# EAGLE schematic VCO 3340 (EAGLE 9.6.2)

## Sheet 1 of 2
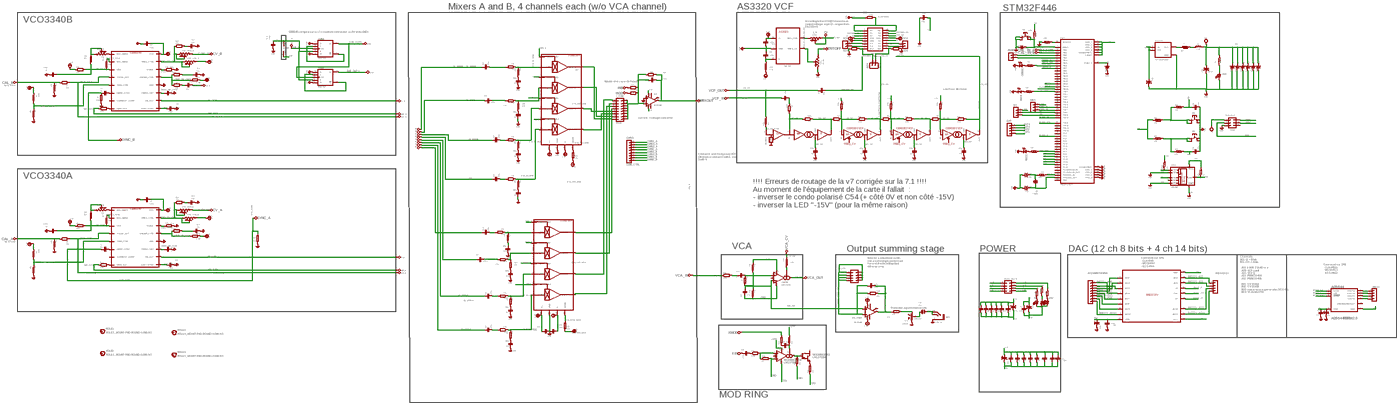
[diagram p0: schematic, sheet 1, overview]
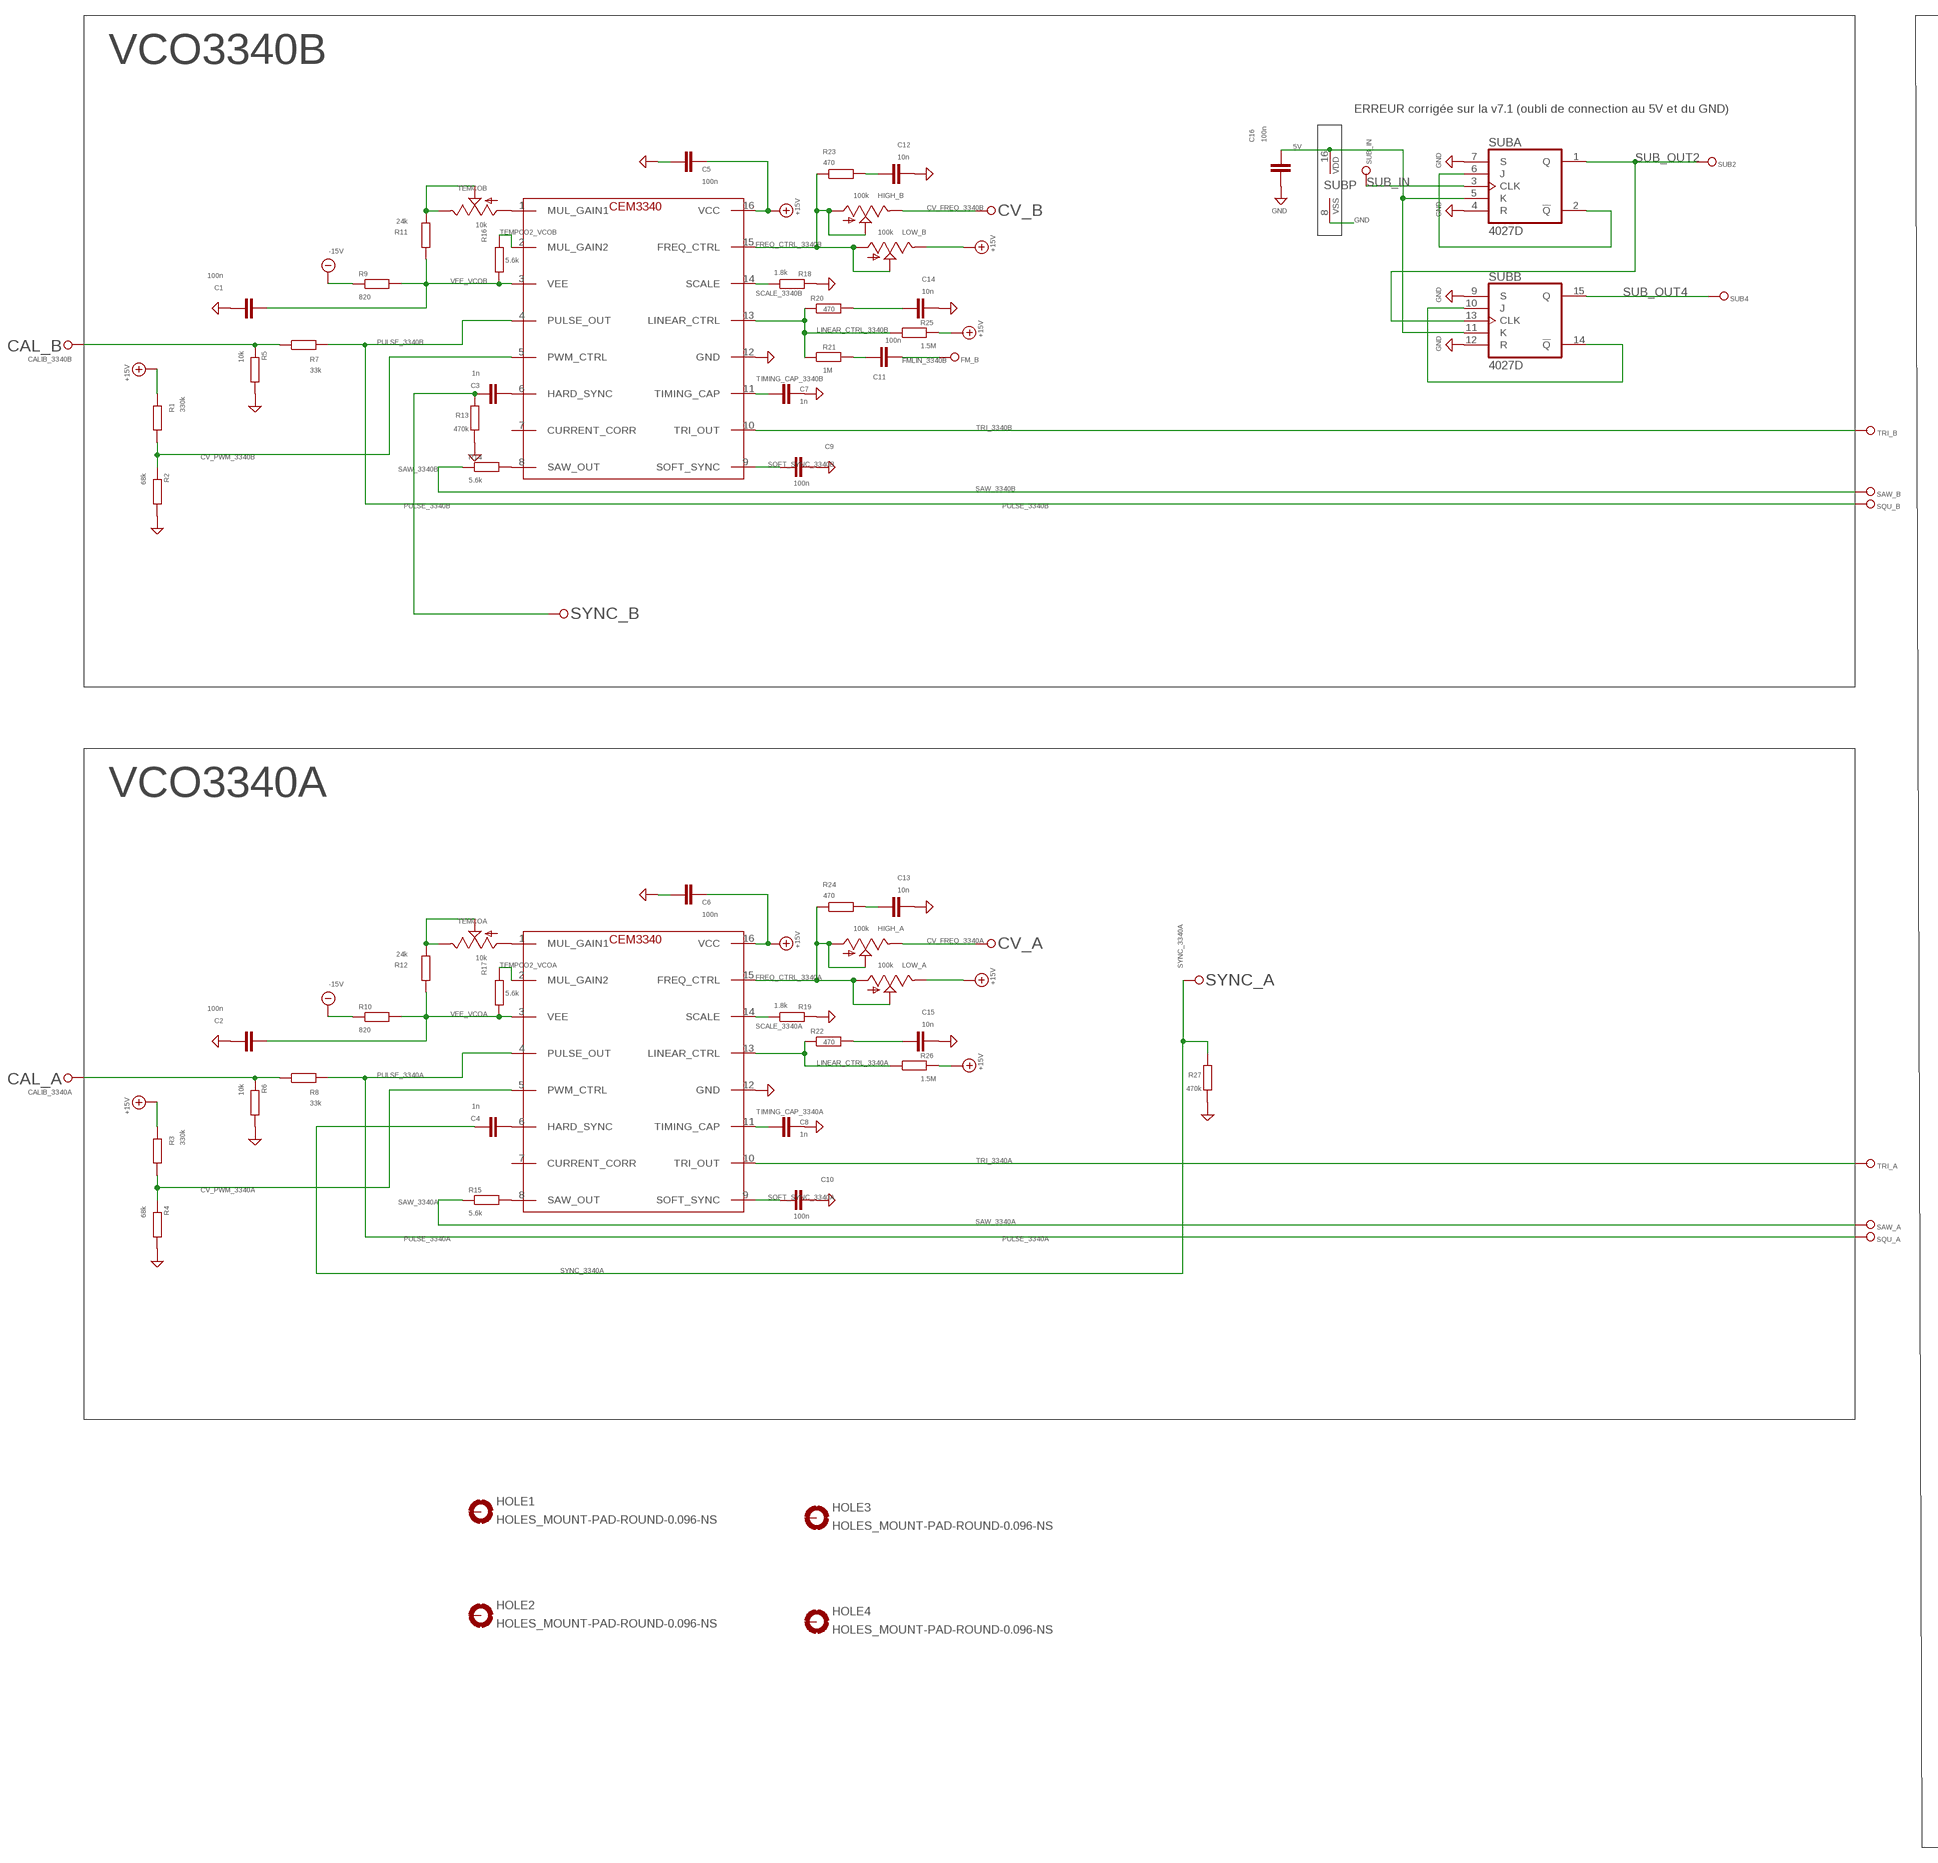
[diagram p1: schematic, sheet 1, part 1 of 4]
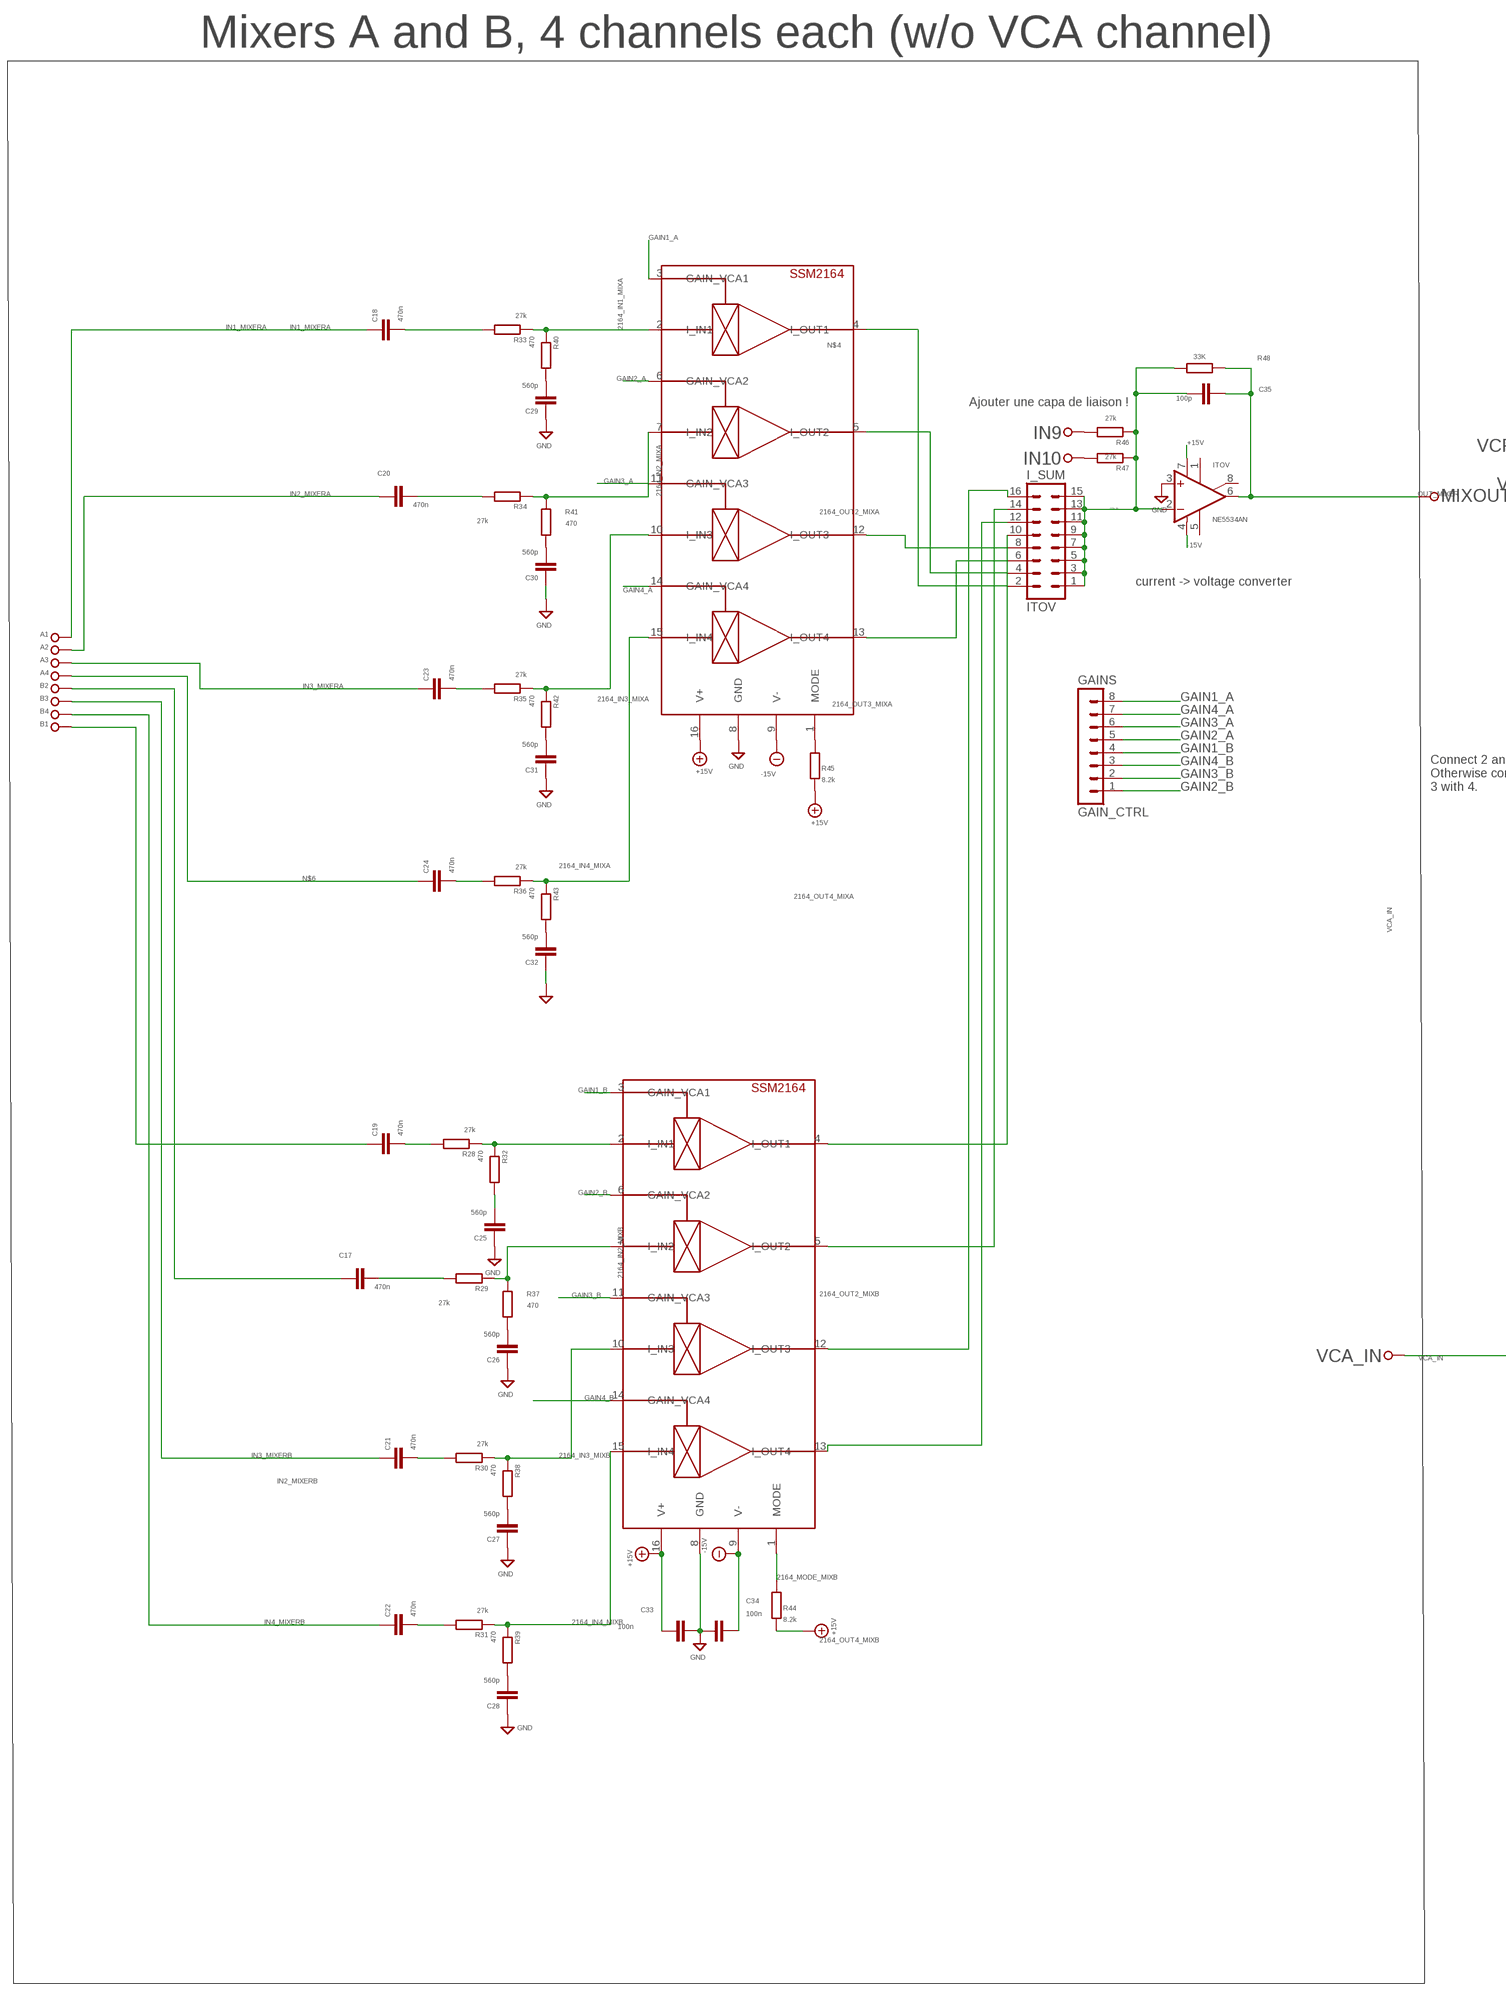
[diagram p2: schematic, sheet 1, part 2 of 4]
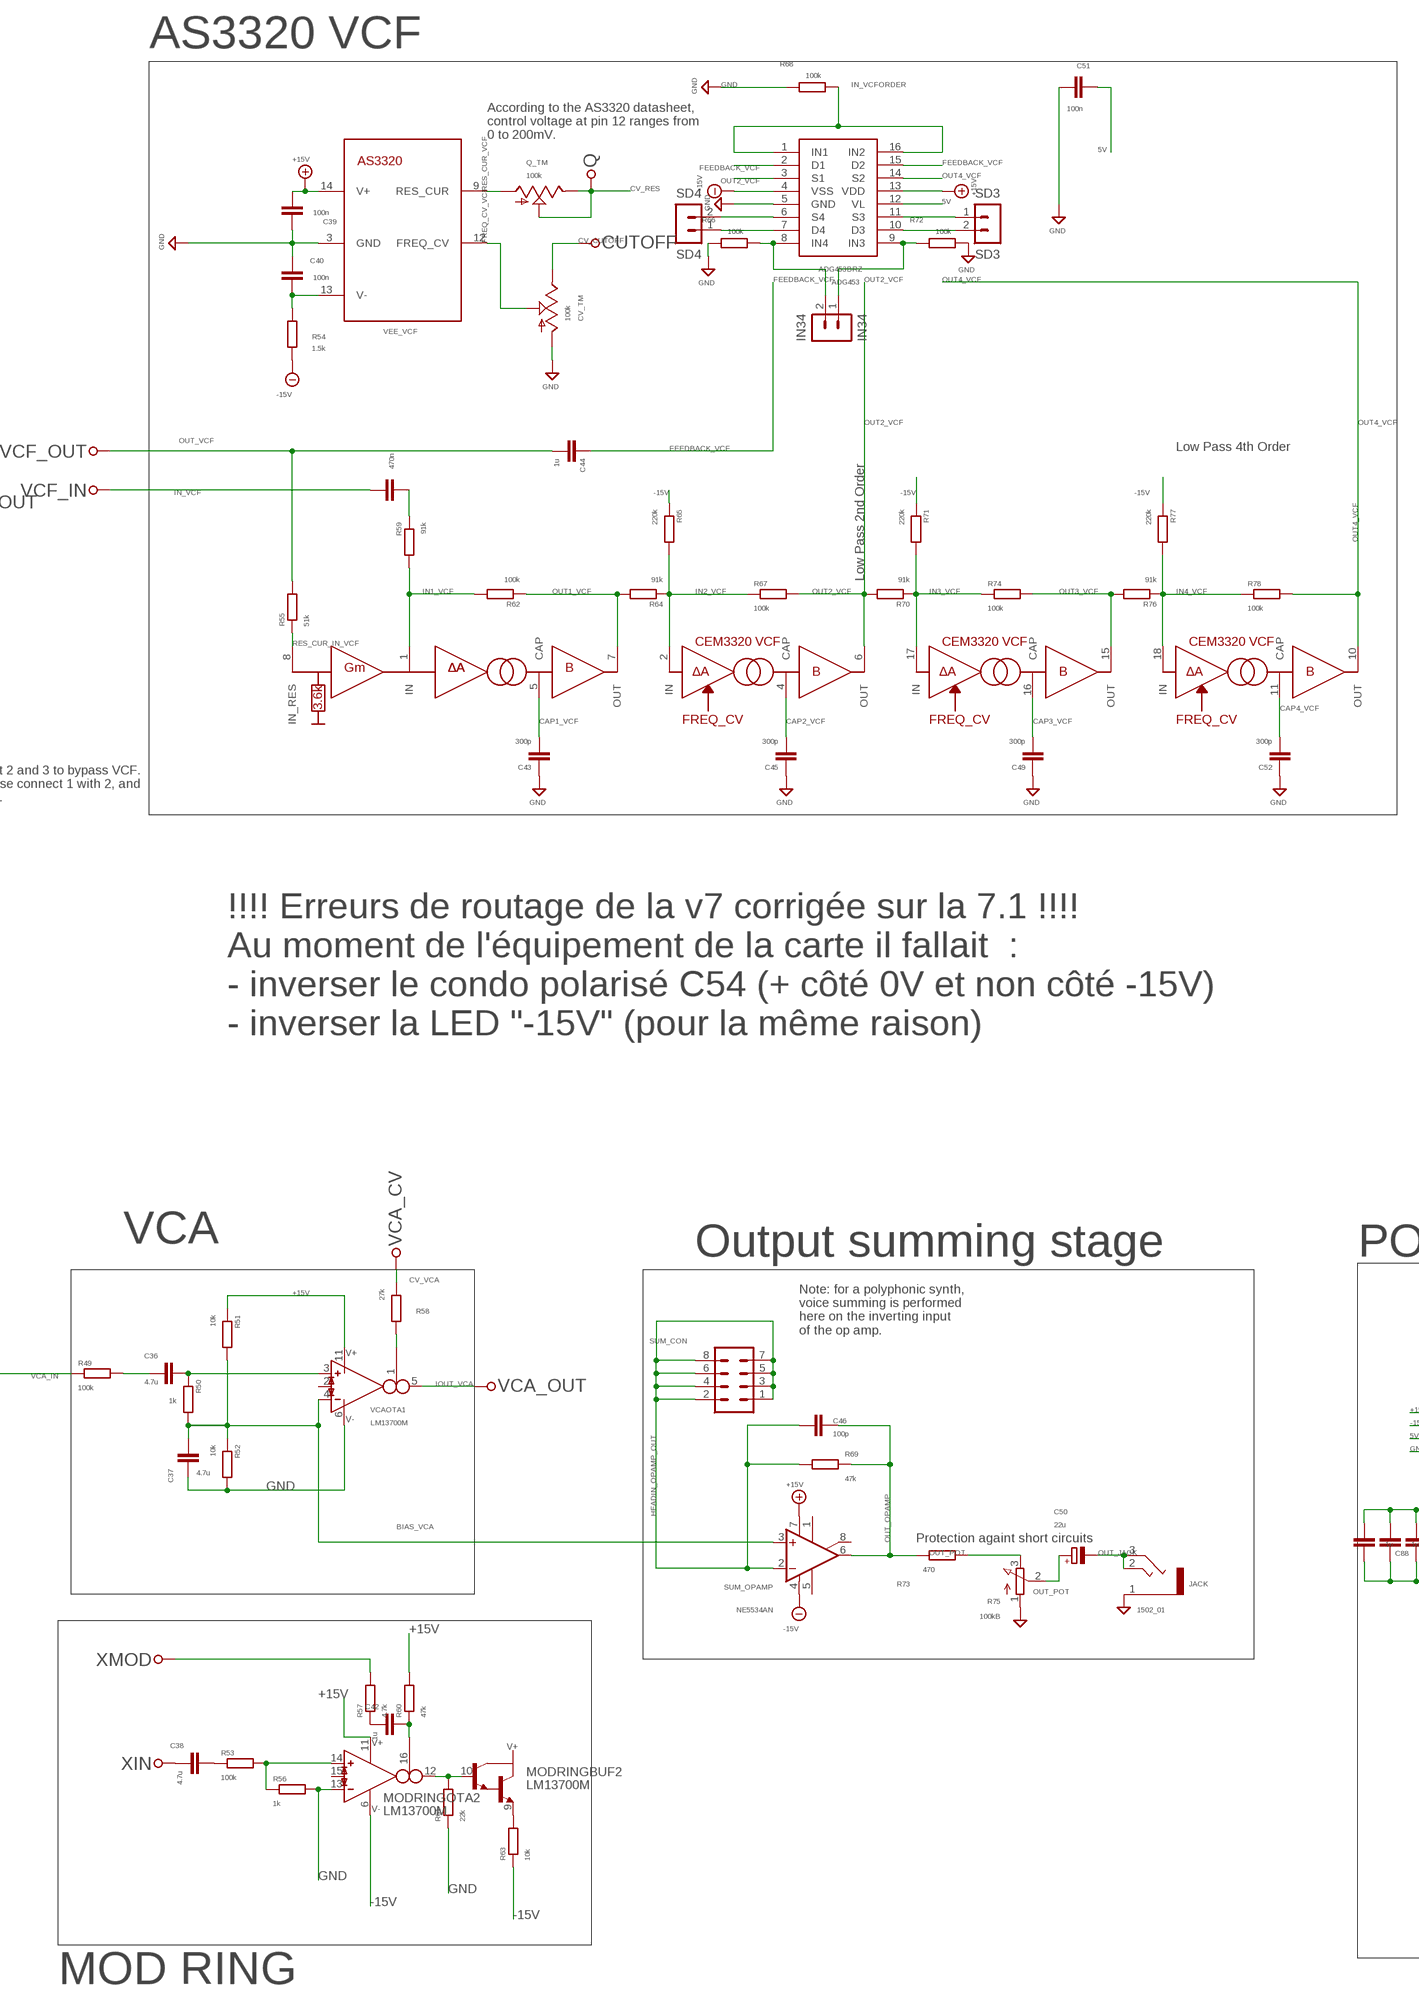
[diagram p3: schematic, sheet 1, part 3 of 4]
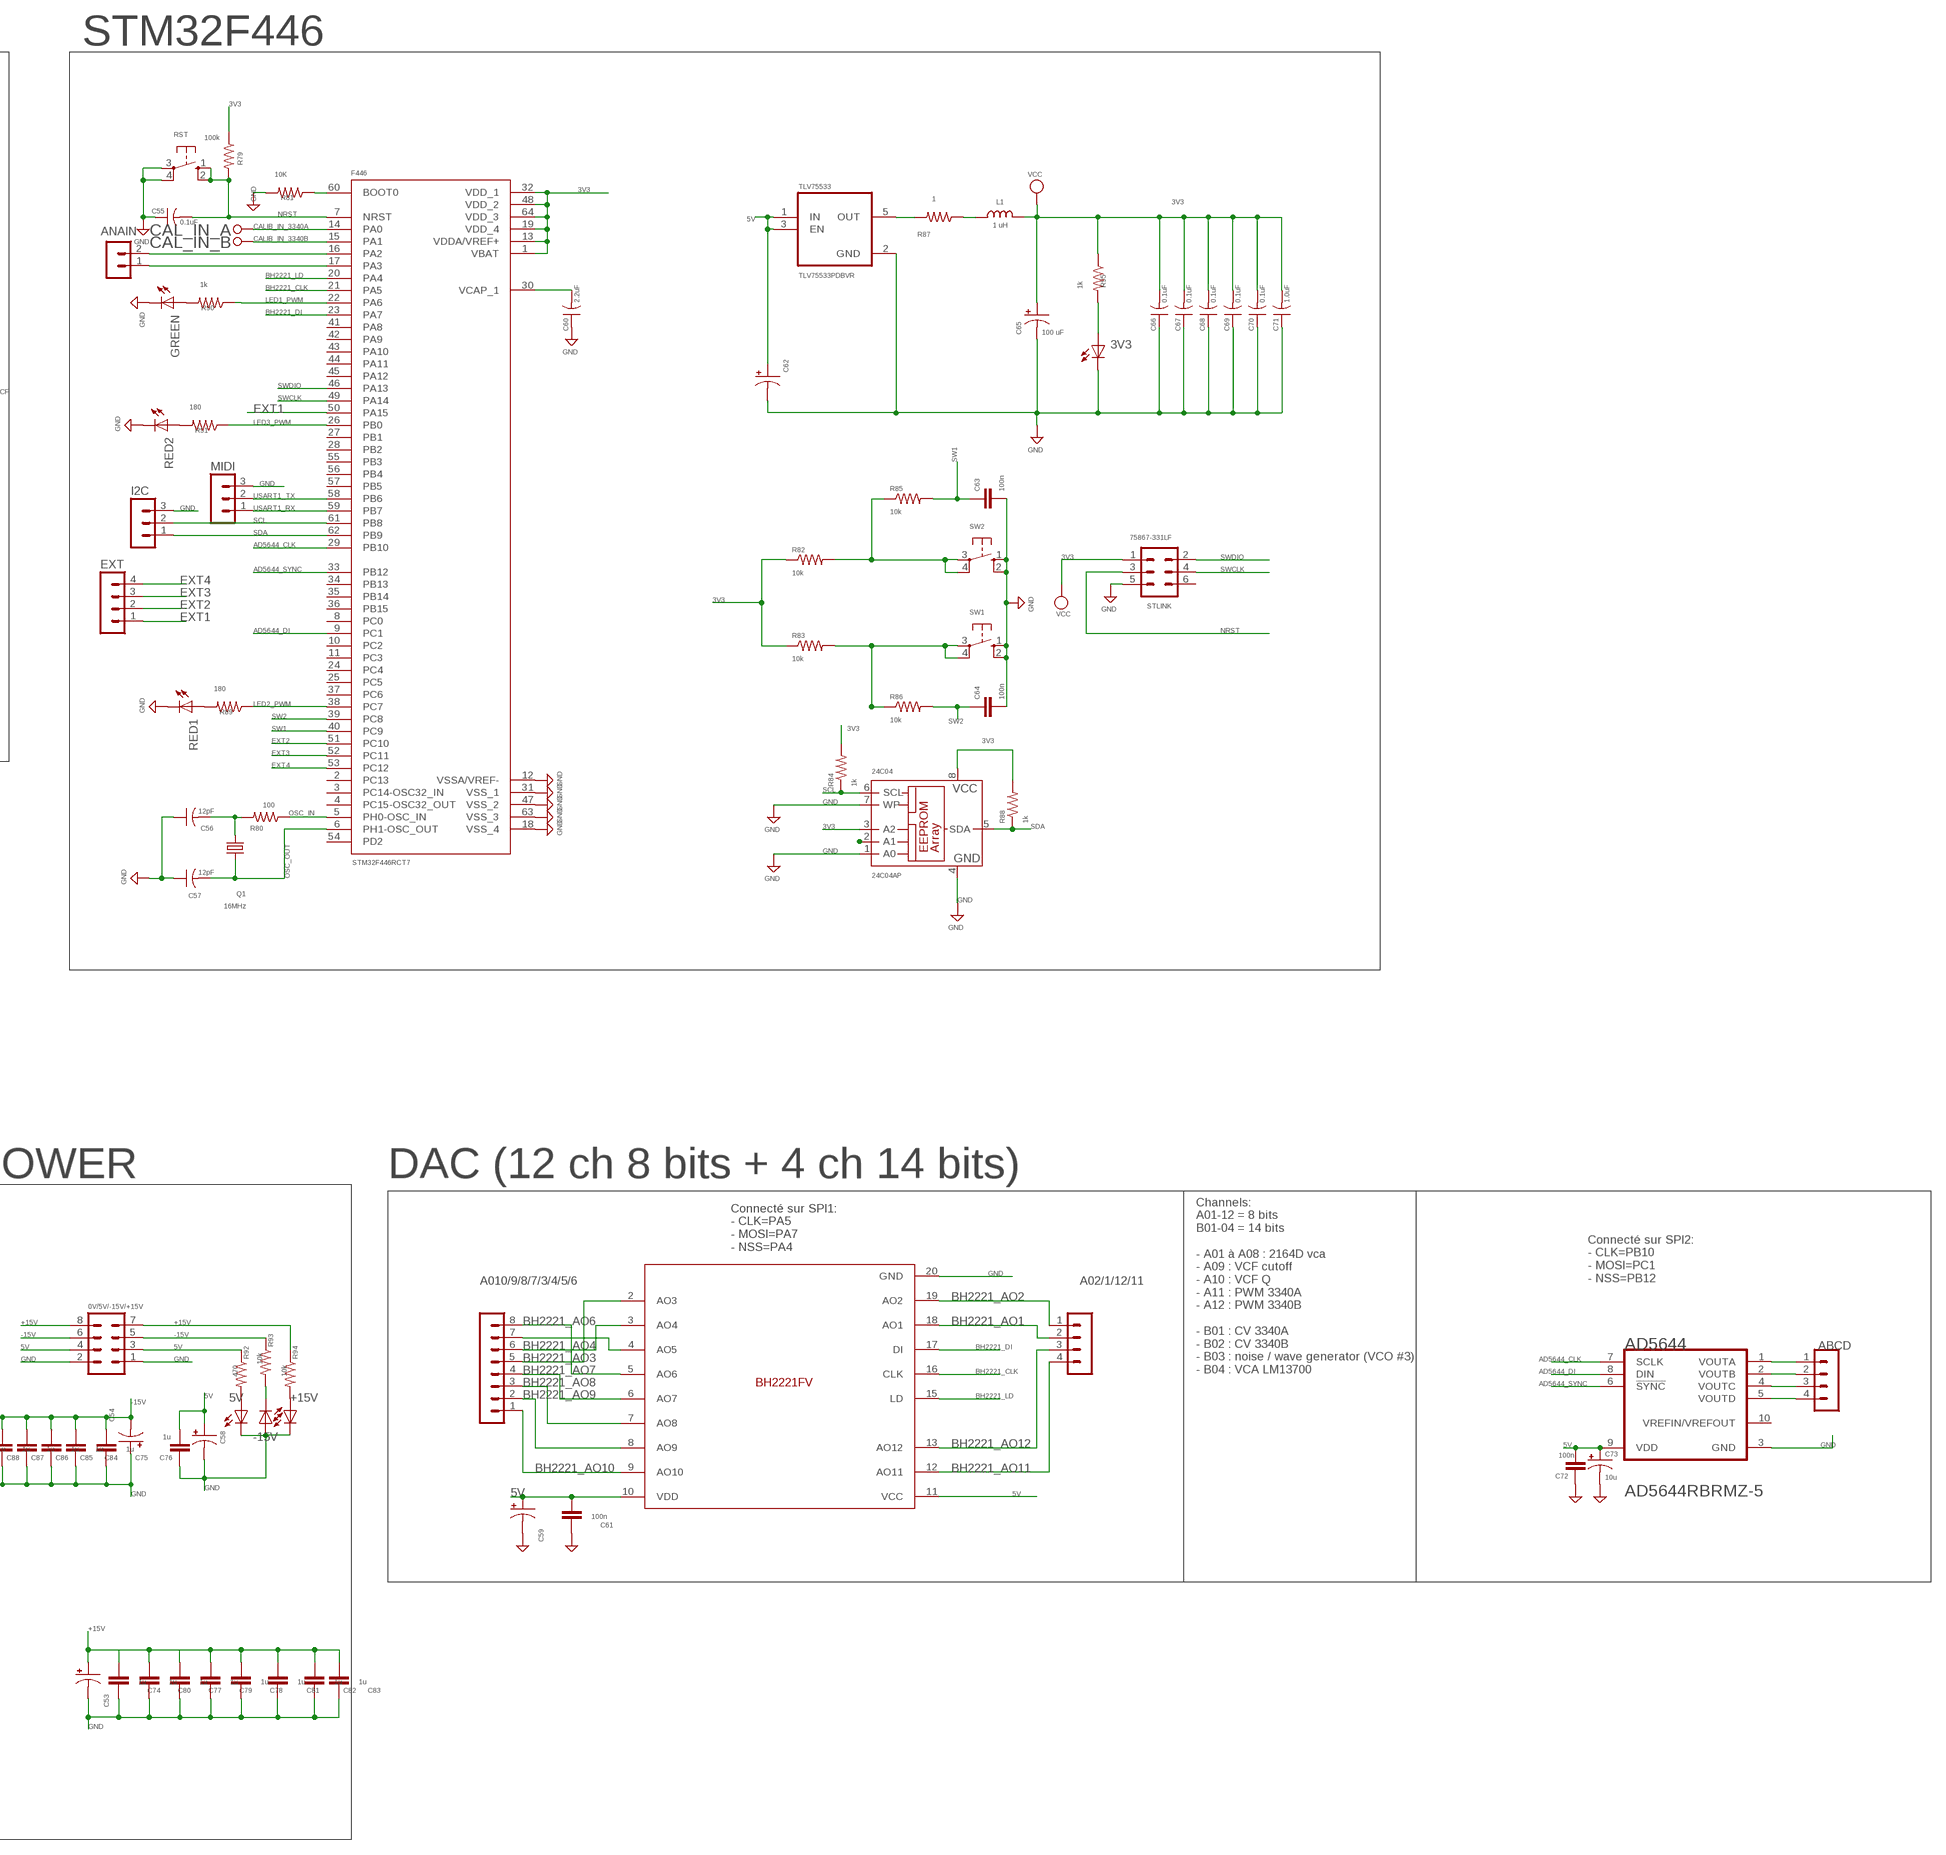
[diagram p4: schematic, sheet 1, part 4 of 4]

### Parts
0V/5V/-15V/+15V  MA04-2  [MA04-2]
3V3  LED-0805  [0805-LED]
5V  LED-0603  [0603-LED]
24C04  24C04AP  [DIL8]
2164A  SSM2164  [DIL16]
2164B  SSM2164  [DIL16]
3340A  CEM3340  [DIL16]
3340B  CEM3340  [DIL16]
+15V  LED-0805  [0805-LED]
-15V  LED-0805  [0805-LED]
A1  T  TESTPOINT  [TESTPOINT_63]
A2  T  TESTPOINT  [TESTPOINT_63]
A02/1/12/11  MA04-1  [MA04-1]
A3  T  TESTPOINT  [TESTPOINT_63]
A4  T  TESTPOINT  [TESTPOINT_63]
A010/9/8/7/3/4/5/6  MA08-1  [MA08-1]
ABCD  MA04-1  [MA04-1]
AD5644  ANALOG_DEVICES_AD5644RBRMZ-5ANALOG_DEVICES_AD5644RBRMZ-5_0_0  [ANALOG_DEVICES_AD5644RBRMZ-5_0]
ADG453  ADG453BRZ  [SOIC127P600X175-16N]
ANAIN  MA02-1  [MA02-1]
B1  T  TESTPOINT  [TESTPOINT_63]
B2  T  TESTPOINT  [TESTPOINT_63]
B3  T  TESTPOINT  [TESTPOINT_63]
B4  T  TESTPOINT  [TESTPOINT_63]
BH2221  BH2221FV  [SOP65P780X200-20N]
C1  100n  C-EUC0805  [C0805]
C2  100n  C-EUC0805  [C0805]
C3  1n  C-EUC0805  [C0805]
C4  1n  C-EUC0805  [C0805]
C5  100n  C-EUC0805  [C0805]
C6  100n  C-EUC0805  [C0805]
C7  1n  C-EUC0805  [C0805]
C8  1n  C-EUC0805  [C0805]
C9  100n  C-EUC0805  [C0805]
C10  100n  C-EUC0805  [C0805]
C11  100n  C-EUC0805  [C0805]
C12  10n  C-EUC0805  [C0805]
C13  10n  C-EUC0805  [C0805]
C14  10n  C-EUC0805  [C0805]
C15  10n  C-EUC0805  [C0805]
C16  100n  C-EUC0805  [C0805]
C17  470n  C-EUC0805  [C0805]
C18  470n  C-EUC0805  [C0805]
C19  470n  C-EUC0805  [C0805]
C20  470n  C-EUC0805  [C0805]
C21  470n  C-EUC0805  [C0805]
C22  470n  C-EUC0805  [C0805]
C23  470n  C-EUC0805  [C0805]
C24  470n  C-EUC0805  [C0805]
C25  560p  C-EUC0805  [C0805]
C26  560p  C-EUC0805  [C0805]
C27  560p  C-EUC0805  [C0805]
C28  560p  C-EUC0805  [C0805]
C29  560p  C-EUC0805  [C0805]
C30  560p  C-EUC0805  [C0805]
C31  560p  C-EUC0805  [C0805]
C32  560p  C-EUC0805  [C0805]
C33  100n  C-EUC0805  [C0805]
C34  100n  C-EUC0805  [C0805]
C35  100p  C-EUC0805  [C0805]
C36  4.7u  C-EUC0805  [C0805]
C37  4.7u  C-EUC0805  [C0805]
C38  4.7u  C-EUC0805  [C0805]
C39  100n  C-EUC0805  [C0805]
C40  100n  C-EUC0805  [C0805]
C41  470n  C-EUC0805  [C0805]
C42  1u  C-EUC0805  [C0805]
C43  300p  C-EUC0805  [C0805]
C44  1u  C-EUC0805  [C0805]
C45  300p  C-EUC0805  [C0805]
C46  100p  C-EUC0805  [C0805]
C49  300p  C-EUC0805  [C0805]
C50  22u  CPOL-EUB45181A  [B45181A]
C51  100n  C-EUC0805  [C0805]
C52  300p  C-EUC0805  [C0805]
C53  10u  CPOL-US2917  [CPOL2917]
C54  10u  CPOL-US2917  [CPOL2917]
C55  0.1uF  C-US0805  [C0805]
C56  12pF  C-US0805  [C0805]
C57  12pF  C-US0805  [C0805]
C58  10u  CPOL-US2917  [CPOL2917]
C59  10u  CPOL-US2917  [CPOL2917]
C60  2.2uF  C-US0805  [C0805]
C61  100n  C-EUC1206  [C1206]
C62  10u  CPOL-US2917  [CPOL2917]
C63  100n  C-EUC0805  [C0805]
C64  100n  C-EUC0805  [C0805]
C65  100 uF  CPOL-US2917  [CPOL2917]
C66  0.1uF  C-US0805  [C0805]
C67  0.1uF  C-US0805  [C0805]
C68  0.1uF  C-US0805  [C0805]
C69  0.1uF  C-US0805  [C0805]
C70  0.1uF  C-US0805  [C0805]
C71  1.0uF  C-US0805  [C0805]
C72  100n  C-EUC1206  [C1206]
C73  10u  CPOL-US2917  [CPOL2917]
C74  1u  C-EUC1206  [C1206]
C75  1u  C-EUC1206  [C1206]
C76  1u  C-EUC1206  [C1206]
C77  1u  C-EUC1206  [C1206]
C78  1u  C-EUC1206  [C1206]
C79  1u  C-EUC1206  [C1206]
C80  1u  C-EUC1206  [C1206]
C81  1u  C-EUC1206  [C1206]
C82  1u  C-EUC1206  [C1206]
C83  1u  C-EUC1206  [C1206]
C84  1u  C-EUC1206  [C1206]
C85  1u  C-EUC1206  [C1206]
C86  1u  C-EUC1206  [C1206]
C87  1u  C-EUC1206  [C1206]
C88  1u  C-EUC1206  [C1206]
CAL_A  SYNC_IN  TESTPOINT  [TESTPOINT_63]
CAL_B  CALIB B  TESTPOINT  [TESTPOINT_63]
CAL_IN_A  TESTPOINT  [TESTPOINT_63]
CAL_IN_B  TESTPOINT  [TESTPOINT_63]
CUTOFF  TESTPOINT  [TESTPOINT_63]
CV_A  CV  TESTPOINT  [TESTPOINT_63]
CV_B  CV  TESTPOINT  [TESTPOINT_63]
CV_TM  100k  TRIM  [6MM]
EXT  MA04-1  [MA04-1]
F446  STM32F446RCT7  [QFP50P1200X1200X160-64N]
FM_B  FMLIN  TESTPOINT  [TESTPOINT_63]
GAINS  GAIN_CTRL  MA08-1  [MA08-1]
GREEN  LED-0805  [0805-LED]
HIGH_A  100k  TRIM  [6MM]
HIGH_B  100k  TRIM  [6MM]
HOLE1  HOLES_MOUNT-PAD-ROUND-0.096-NS  [HOLES_096-PAD-NS]
HOLE2  HOLES_MOUNT-PAD-ROUND-0.096-NS  [HOLES_096-PAD-NS]
HOLE3  HOLES_MOUNT-PAD-ROUND-0.096-NS  [HOLES_096-PAD-NS]
HOLE4  HOLES_MOUNT-PAD-ROUND-0.096-NS  [HOLES_096-PAD-NS]
I2C  MA03-1  [MA03-1]
I_SUM  ITOV  MA08-2  [MA08-2]
IN9  TESTPOINT  [TESTPOINT_63]
IN10  TESTPOINT  [TESTPOINT_63]
IN34  IN34  MA02-1  [MA02-1]
ITOV  NE5534AN  [DIL08]
JACK  1502_01  [1502_01]
L1  1 uH  L-USL0805  [L0805]
LOW_A  100k  TRIM  [6MM]
LOW_B  100k  TRIM  [6MM]
MIDI  MA03-1  [MA03-1]
MIXOUT  TESTPOINT  [TESTPOINT_63]
MODRING  LM13700M  [SO16]
Q  TESTPOINT  [TESTPOINT_63]
Q1  16MHz  Q-HSEHC-46X  [Q-HC-46X]
Q_TM  100k  TRIM  [6MM]
R1  330k  R-EU_R0805  [R0805]
R2  68k  R-EU_R0805  [R0805]
R3  330k  R-EU_R0805  [R0805]
R4  68k  R-EU_R0805  [R0805]
R5  10k  R-EU_R0805  [R0805]
R6  10k  R-EU_R0805  [R0805]
R7  33k  R-EU_R0805  [R0805]
R8  33k  R-EU_R0805  [R0805]
R9  820  R-EU_R0805  [R0805]
R10  820  R-EU_R0805  [R0805]
R11  24k  R-EU_R0805  [R0805]
R12  24k  R-EU_R0805  [R0805]
R13  470k  R-EU_R0805  [R0805]
R14  5.6k  R-EU_R0805  [R0805]
R15  5.6k  R-EU_R0805  [R0805]
R16  5.6k  R-EU_R0805  [R0805]
R17  5.6k  R-EU_R0805  [R0805]
R18  1.8k  R-EU_R0805  [R0805]
R19  1.8k  R-EU_R0805  [R0805]
R20  470  R-EU_R0805  [R0805]
R21  1M  R-EU_R0805  [R0805]
R22  470  R-EU_R0805  [R0805]
R23  470  R-EU_R0805  [R0805]
R24  470  R-EU_R0805  [R0805]
R25  1.5M  R-EU_R0805  [R0805]
R26  1.5M  R-EU_R0805  [R0805]
R27  470k  R-EU_R0805  [R0805]
R28  27k  R-EU_R0805  [R0805]
R29  27k  R-EU_R0805  [R0805]
R30  27k  R-EU_R0805  [R0805]
R31  27k  R-EU_R0805  [R0805]
R32  470  R-EU_R0805  [R0805]
R33  27k  R-EU_R0805  [R0805]
R34  27k  R-EU_R0805  [R0805]
R35  27k  R-EU_R0805  [R0805]
R36  27k  R-EU_R0805  [R0805]
R37  470  R-EU_R0805  [R0805]
R38  470  R-EU_R0805  [R0805]
R39  470  R-EU_R0805  [R0805]
R40  470  R-EU_R0805  [R0805]
R41  470  R-EU_R0805  [R0805]
R42  470  R-EU_R0805  [R0805]
R43  470  R-EU_R0805  [R0805]
R44  8.2k  R-EU_R0805  [R0805]
R45  8.2k  R-EU_R0805  [R0805]
R46  27k  R-EU_R0805  [R0805]
R47  27k  R-EU_R0805  [R0805]
R48  33K  R-EU_R0805  [R0805]
R49  100k  R-EU_R0805  [R0805]
R50  1k  R-EU_R0805  [R0805]
R51  10k  R-EU_R0805  [R0805]
R52  10k  R-EU_R0805  [R0805]
R53  100k  R-EU_R0805  [R0805]
R54  1.5k  R-EU_R0805  [R0805]
R55  51k  R-EU_R0805  [R0805]
R56  1k  R-EU_R0805  [R0805]
R57  4.7k  R-EU_R0805  [R0805]
R58  27k  R-EU_R0805  [R0805]
R59  91k  R-EU_R0805  [R0805]
R60  47k  R-EU_R0805  [R0805]
R61  22k  R-EU_R0805  [R0805]
R62  100k  R-EU_R0805  [R0805]
R63  10k  R-EU_R0805  [R0805]
R64  91k  R-EU_R0805  [R0805]
R65  220k  R-EU_R0805  [R0805]
R66  100k  R-EU_R0805  [R0805]
R67  100k  R-EU_R0805  [R0805]
R68  100k  R-EU_R0805  [R0805]
R69  47k  R-EU_R0805  [R0805]
R70  91k  R-EU_R0805  [R0805]
R71  220k  R-EU_R0805  [R0805]
R72  100k  R-EU_R0805  [R0805]
R73  470  R-EU_R0805  [R0805]
R74  100k  R-EU_R0805  [R0805]
R75  100kB  3RP/1610N  [3RP/1610N]
R76  91k  R-EU_R0805  [R0805]
R77  220k  R-EU_R0805  [R0805]
R78  100k  R-EU_R0805  [R0805]
R79  100k  R-US0805  [R0805]
R80  100  R-US0805  [R0805]
R81  10K  R-US0805  [R0805]
R82  10k  R-US_R0805  [R0805]
R83  10k  R-US_R0805  [R0805]
R84  1k  R-US_R0805  [R0805]
R85  10k  R-US_R0805  [R0805]
R86  10k  R-US_R0805  [R0805]
R87  1  R-US0805  [R0805]
R88  1k  R-US_R0805  [R0805]
R89  180  R-US0805  [R0805]
R90  1k  R-US0805  [R0805]
R91  180  R-US0805  [R0805]
R92  470  R-US0805  [R0805]
R93  10k  R-US0805  [R0805]
R94  10k  R-US0805  [R0805]
R95  1k  R-US0805  [R0805]
RED1  LED-0603  [0603-LED]
RED2  LED-0603  [0603-LED]
RST  10-XX  [B3F-10XX]
SAW_A  S  TESTPOINT  [TESTPOINT_63]
SAW_B  S  TESTPOINT  [TESTPOINT_63]
SD3  SD3  MA02-1  [MA02-1]
SD4  SD4  MA02-1  [MA02-1]
SQU_A  P  TESTPOINT  [TESTPOINT_63]
SQU_B  P  TESTPOINT  [TESTPOINT_63]
STLINK  75867-331LF  MA03-2  [MA03-2]
SUB  4027D  [SO16]
SUB2  T  TESTPOINT  [TESTPOINT_63]
SUB4  T  TESTPOINT  [TESTPOINT_63]
SUB_IN  T  TESTPOINT  [TESTPOINT_63]
SUM_CON  MA04-2  [MA04-2]
SUM_OPAMP  NE5534AN  [DIL08]
SW1  10-XX  [B3F-10XX]
SW2  10-XX  [B3F-10XX]
SYNC_A  SYNC_IN  TESTPOINT  [TESTPOINT_63]
SYNC_B  SYNC_IN  TESTPOINT  [TESTPOINT_63]
TEMCOA  10k  TRIM  [6MM]
TEMCOB  10k  TRIM  [6MM]
TLV75533  TLV75533PDBVR  [SOT95P280X145-5N]
TRI_A  T  TESTPOINT  [TESTPOINT_63]
TRI_B  T  TESTPOINT  [TESTPOINT_63]
VCA  LM13700M  [SO16]
VCA_CV  TESTPOINT  [TESTPOINT_63]
VCA_IN  TESTPOINT  [TESTPOINT_63]
VCA_OUT  TESTPOINT  [TESTPOINT_63]
VCF1  AS3320  [DIL18]
VCF_IN  TESTPOINT  [TESTPOINT_63]
VCF_OUT  TESTPOINT  [TESTPOINT_63]
XIN  TESTPOINT  [TESTPOINT_63]
XMOD  TESTPOINT  [TESTPOINT_63]

### Nets
3V3: 24C04.2(A1) 24C04.3(A2) 24C04.8(VCC) C65.+ C66.2 C67.2 C68.2 C69.2 C70.2 C71.2 F446.1(VBAT) F446.13(VDDA/VREF+) F446.19(VDD_4) F446.32(VDD_1) F446.48(VDD_2) F446.64(VDD_3) L1.2 R79.1 R82.1 R83.1 R84.2 R88.2 R95.1 STLINK.1 ; supply symbol labelled VCC
5V: 0V/5V/-15V/+15V.3 0V/5V/-15V/+15V.4 AD5644.9(VDD) ADG453.12(VL) BH2221.10(VDD) BH2221.11(VCC) C16.1 C51.1 C58.+ C59.+ C61.2 C62.+ C72.2 C73.+ C76.2 R92.1 SUB.5(A:K) SUB.11(B:K) SUB.16(P:VDD) TLV75533.1(IN) TLV75533.3(EN)
2164_IN1_MIXA: 2164A.2(I_IN1) R33.1 R40.1
2164_IN2_MIXA: 2164A.7(I_IN2) R34.1 R41.1
2164_IN2_MIXB: 2164B.7(I_IN2) R29.1 R37.1
2164_IN3_MIXA: 2164A.10(I_IN3) R35.1 R42.1
2164_IN3_MIXB: 2164B.10(I_IN3) R30.1 R38.1
2164_IN4_MIXA: 2164A.15(I_IN4) R36.1 R43.1
2164_IN4_MIXB: 2164B.15(I_IN4) R31.1 R39.1
2164_IN4_MIXB1: 2164B.2(I_IN1) R28.1 R32.1
2164_MODE_MIXB: 2164B.1(MODE) R44.2
2164_OUT2_MIXA: 2164A.5(I_OUT2) I_SUM.4
2164_OUT2_MIXB: 2164B.5(I_OUT2) I_SUM.14
2164_OUT3_MIXA: 2164A.12(I_OUT3) I_SUM.8
2164_OUT3_MIXB: 2164B.12(I_OUT3) I_SUM.16
2164_OUT4_MIXA: 2164A.13(I_OUT4) I_SUM.6
2164_OUT4_MIXB: 2164B.13(I_OUT4) I_SUM.12
+15V: 0V/5V/-15V/+15V.7 0V/5V/-15V/+15V.8 2164A.16(V+) 2164B.16(V+) 3340A.16(VCC) 3340B.16(VCC) ADG453.13(VDD) C5.2 C6.2 C33.2 C39.2 C53.+ C74.2 C77.2 C78.2 C79.2 C80.2 C81.2 C82.2 C83.2 ITOV.7(V+) LOW_A.E LOW_B.E MODRING.11(SUPPLY:V+) R1.2 R3.2 R25.2 R26.2 R44.1 R45.1 R51.1 R60.2 R94.1 SUM_OPAMP.7(V+) VCA.11(SUPPLY:V+) VCF1.14(POW$1:V+)
-15V: 0V/5V/-15V/+15V.5 0V/5V/-15V/+15V.6 2164A.9(V-) 2164B.9(V-) ADG453.4(VSS) C34.1 C54.- C75.2 C84.2 C85.2 C86.2 C87.2 C88.2 ITOV.4(V-) MODRING.6(SUPPLY:V-) R9.1 R10.1 R54.1 R63.1 R65.1 R71.1 R77.1 R93.1 SUM_OPAMP.4(V-)
AD5644_CLK: AD5644.7(SCLK) F446.29(PB10)
AD5644_DI: AD5644.8(DIN) F446.9(PC1)
AD5644_SYNC: AD5644.6(!SYNC!) F446.33(PB12)
BH2221_AO1: A02/1/12/11.2 BH2221.18(AO1)
BH2221_AO2: A02/1/12/11.1 BH2221.19(AO2)
BH2221_AO3: A010/9/8/7/3/4/5/6.5 BH2221.2(AO3)
BH2221_AO4: A010/9/8/7/3/4/5/6.6 BH2221.3(AO4)
BH2221_AO6: A010/9/8/7/3/4/5/6.8 BH2221.5(AO6)
BH2221_AO7: A010/9/8/7/3/4/5/6.4 BH2221.6(AO7)
BH2221_AO8: A010/9/8/7/3/4/5/6.3 BH2221.7(AO8)
BH2221_AO9: A010/9/8/7/3/4/5/6.2 BH2221.8(AO9)
BH2221_AO10: A010/9/8/7/3/4/5/6.1 BH2221.9(AO10)
BH2221_AO11: A02/1/12/11.4 BH2221.12(AO11)
BH2221_AO12: A02/1/12/11.3 BH2221.13(AO12)
BH2221_CLK: BH2221.16(CLK) F446.21(PA5)
BH2221_DI: BH2221.17(DI) F446.23(PA7)
BH2221_LD: BH2221.15(LD) F446.20(PA4)
BIAS_VCA: C37.1 R50.2 R51.2 R52.1 SUM_OPAMP.3(+IN) VCA.4(OTA1:IN_N)
BOOT1: F446.60(BOOT0) R81.1
CALIB_3340A: CAL_A.P$1 R6.1 R8.1
CALIB_3340B: CAL_B.P$1 R5.1 R7.1
CALIB_IN_3340A: CAL_IN_A.P$1 F446.14(PA0)
CALIB_IN_3340B: CAL_IN_B.P$1 F446.15(PA1)
CAP1_VCF: C43.2 VCF1.5(OTA$1:CAP)
CAP2_VCF: C45.2 VCF1.4(OTA$2:CAP)
CAP3_VCF: C49.2 VCF1.16(OTA$4:CAP)
CAP4_VCF: C52.2 VCF1.11(OTA$3:CAP)
CV_CUTOFF: CUTOFF.P$1 CV_TM.E
CV_FREQ_3340A: CV_A.P$1 HIGH_A.E
CV_FREQ_3340B: CV_B.P$1 HIGH_B.E
CV_PWM_3340A: 3340A.5(PWM_CTRL) R3.1 R4.1
CV_PWM_3340B: 3340B.5(PWM_CTRL) R1.1 R2.1
CV_RES: Q.P$1 Q_TM.E Q_TM.S
CV_VCA: R58.1 VCA_CV.P$1
EXT1: EXT.1 F446.50(PA15)
EXT2: EXT.2 F446.51(PC10)
EXT3: EXT.3 F446.52(PC11)
EXT4: EXT.4 F446.53(PC12)
FEEDBACK_VCF: ADG453.2(D1) ADG453.15(D2) C44.1
FMLIN_3340B: C11.2 FM_B.P$1
FREQ_CTRL_3340A: 3340A.15(FREQ_CTRL) HIGH_A.A HIGH_A.S LOW_A.A LOW_A.S R24.1
FREQ_CTRL_3340B: 3340B.15(FREQ_CTRL) HIGH_B.A HIGH_B.S LOW_B.A LOW_B.S R23.1
FREQ_CV_VCF: CV_TM.S VCF1.12(POW$1:FREQ_CV)
GAIN1_A: 2164A.3(GAIN_VCA1) GAINS.8
GAIN1_B: 2164B.3(GAIN_VCA1) GAINS.4
GAIN2_A: 2164A.6(GAIN_VCA2) GAINS.5
GAIN2_B: 2164B.6(GAIN_VCA2) GAINS.1
GAIN3_A: 2164A.11(GAIN_VCA3) GAINS.6
GAIN3_B: 2164B.11(GAIN_VCA3) GAINS.2
GAIN4_A: 2164A.14(GAIN_VCA4) GAINS.7
GAIN4_B: 2164B.14(GAIN_VCA4) GAINS.3
GND: 0V/5V/-15V/+15V.1 0V/5V/-15V/+15V.2 3V3.C 5V.C 24C04.1(A0) 24C04.4(GND) 24C04.7(WP) 2164A.8(GND) 2164B.8(GND) 3340A.12(GND) 3340B.12(GND) +15V.C -15V.A AD5644.3(GND) ADG453.5(GND) BH2221.20(GND) C1.1 C2.1 C5.1 C6.1 C7.1 C8.1 C9.1 C10.1 C12.1 C13.1 C14.2 C15.2 C16.2 C25.1 C26.1 C27.1 C28.1 C29.1 C30.1 C31.1 C32.1 C33.1 C34.2 C37.2 C39.1 C40.2 C43.1 C45.1 C49.1 C51.2 C52.1 C53.- C54.+ C55.1 C56.1 C57.1 C58.- C59.- C60.1 C61.1 C62.- C63.2 C64.2 C65.- C66.1 C67.1 C68.1 C69.1 C70.1 C71.1 C72.1 C73.- C74.1 C75.1 C76.1 C77.1 C78.1 C79.1 C80.1 C81.1 C82.1 C83.1 C84.1 C85.1 C86.1 C87.1 C88.1 CV_TM.A F446.12(VSSA/VREF-) F446.18(VSS_4) F446.31(VSS_1) F446.47(VSS_2) F446.63(VSS_3) GREEN.C I2C.3 ITOV.3(+IN) JACK.1 MIDI.3 MODRING.13(OTA2:IN_N) R2.2 R4.2 R5.2 R6.2 R13.1 R18.2 R19.2 R27.1 R52.2 R56.2 R61.1 R66.1 R68.1 R72.2 R75.1(A) R81.2 RED1.C RED2.C RST.3(P) RST.4(P1) STLINK.5 SUB.4(A:R) SUB.7(A:S) SUB.8(P:VSS) SUB.9(B:S) SUB.12(B:R) SW1.1(S) SW1.2(S1) SW2.1(S) SW2.2(S1) TLV75533.2(GND) VCA.6(SUPPLY:V-) VCF1.3(POW$1:GND)
HEADIN_OPAMP_OUT: C46.2 R69.2 SUM_CON.1 SUM_CON.2 SUM_CON.3 SUM_CON.4 SUM_CON.5 SUM_CON.6 SUM_CON.7 SUM_CON.8 SUM_OPAMP.2(-IN)
IN1_MIXERA: A1.P$1 C18.1
IN1_VCF: R59.2 R62.2 VCF1.1(OTA$1:IN)
IN2_MIXERA: A2.P$1 C20.1
IN2_MIXERB: B2.P$1 C17.1
IN2_VCF: R64.1 R65.2 R67.1 VCF1.2(OTA$2:IN)
IN3_MIXERA: A3.P$1 C23.1
IN3_MIXERB: B3.P$1 C21.1
IN3_VCF: R70.1 R71.2 R74.1 VCF1.17(OTA$4:IN)
IN4_MIXERB: B4.P$1 C22.1
IN4_MIXERB1: B1.P$1 C19.1
IN4_VCF: R76.1 R77.2 R78.1 VCF1.18(OTA$3:IN)
IN_VCF: C41.2 VCF_IN.P$1
IN_VCFORDER: ADG453.1(IN1) ADG453.16(IN2) R68.2
IOUT_VCA: VCA.5(OTA1:OUT) VCA_OUT.P$1
ITOV_IN: C35.1 I_SUM.1 I_SUM.3 I_SUM.5 I_SUM.7 I_SUM.9 I_SUM.11 I_SUM.13 I_SUM.15 ITOV.2(-IN) R46.1 R47.1 R48.1
LED1_PWM: F446.22(PA6) R90.1
LED2_PWM: F446.38(PC7) R89.1
LED3_PWM: F446.26(PB0) R91.1
LINEAR_CTRL_3340A: 3340A.13(LINEAR_CTRL) R22.1 R26.1
LINEAR_CTRL_3340B: 3340B.13(LINEAR_CTRL) R20.1 R21.1 R25.1
N$1: 2164B.4(I_OUT1) I_SUM.10
N$2: 3340B.6(HARD_SYNC) C3.2
N$3: SUB.10(B:J) SUB.14(B:!Q)
N$4: 2164A.4(I_OUT1) I_SUM.2
N$5: R82.2 R85.1 SW2.3(P) SW2.4(P1)
N$6: A4.P$1 C24.1
N$7: R83.2 R86.1 SW1.3(P) SW1.4(P1)
N$8: C3.1 R13.2 SYNC_B.P$1
N$9: ADG453.6(S4) SD4.2
N$10: C25.2 R32.2
N$11: C19.2 R28.2
N$12: MODRING.14(OTA2:IN_P) R53.2 R56.1
N$13: C36.2 R49.2
N$14: IN9.P$1 R46.2
N$15: IN10.P$1 R47.2
N$16: ADG453.7(D4) SD4.1
N$17: R58.2 VCA.1(OTA1:I_BIAS)
N$18: ADG453.11(S3) SD3.1
N$20: C26.2 R37.2
N$22: C27.2 R38.2
N$23: A010/9/8/7/3/4/5/6.7 BH2221.4(AO5)
N$24: C28.2 R39.2
N$34: ABCD.1 AD5644.1(VOUTA)
N$35: ABCD.2 AD5644.2(VOUTB)
N$36: ADG453.10(D3) SD3.2
N$37: ADG453.9(IN3) IN34.1 R72.1
N$38: 2164A.1(MODE) R45.2
N$39: ABCD.3 AD5644.4(VOUTC)
N$40: ABCD.4 AD5644.5(VOUTD)
N$41: SUB.2(A:!Q) SUB.6(A:J)
N$43: C38.1 R53.1
N$44: MODRING.9(BUF2:E) R63.2
N$45: C42.1 MODRING.16(OTA2:I_BIAS) R60.1
N$46: C42.2 R57.1
N$47: C36.1 R50.1 VCA.3(OTA1:IN_P)
N$48: R89.2 RED1.A
N$49: R57.2 XMOD.P$1
N$50: C38.2 XIN.P$1
N$51: MODRING.10(BUF2:B) MODRING.12(OTA2:OUT) R61.2
N$52: R91.2 RED2.A
N$53: 5V.A R92.2
N$54: -15V.C R93.2
N$55: +15V.A R94.2
N$56: GREEN.A R90.2
N$57: 3V3.A R95.2
N$58: ANAIN.2 F446.16(PA2)
N$59: ANAIN.1 F446.17(PA3)
N$65: C21.2 R30.2
N$69: C17.2 R29.2
N$70: C22.2 R31.2
N$74: C30.2 R41.2
N$75: C29.2 R40.2
N$76: C31.2 R42.2
N$77: C32.2 R43.2
N$78: C18.2 R33.2
N$79: C23.2 R35.2
N$80: C20.2 R34.2
N$81: C24.2 R36.2
N$104: C56.2 Q1.1 R80.2
N$108: R87.2 TLV75533.5(OUT)
N$109: L1.1 R87.1
N$116: C41.1 R59.1
N$171: C12.2 R23.2
N$172: C14.1 R20.2
N$173: 3340B.1(MUL_GAIN1) TEMCOB.A
N$174: R11.1 TEMCOB.E TEMCOB.S
N$175: C11.1 R21.2
N$176: 3340B.8(SAW_OUT) R14.2
N$301: C13.2 R24.2
N$302: C15.1 R22.2
N$303: 3340A.1(MUL_GAIN1) TEMCOA.A
N$304: R12.1 TEMCOA.E TEMCOA.S
N$306: 3340A.8(SAW_OUT) R15.2
N$307: 3340A.6(HARD_SYNC) C4.2
NRST: C55.2 F446.7(NRST) R79.2 RST.1(S) RST.2(S1) STLINK.3
OSC_IN: F446.5(PH0-OSC_IN) R80.1
OSC_OUT: C57.2 F446.6(PH1-OSC_OUT) Q1.2
OUT1_VCF: R62.1 R64.2 VCF1.7(OTA$1:OUT)
OUT2_VCF: ADG453.3(S1) R67.2 R70.2 VCF1.6(OTA$2:OUT)
OUT3_VCF: R74.2 R76.2 VCF1.15(OTA$4:OUT)
OUT4_VCF: ADG453.14(S2) R78.2 VCF1.10(OTA$3:OUT)
OUT_JACK: C50.- JACK.2 JACK.3
OUT_MIXER: C35.2 ITOV.6(OUT) MIXOUT.P$1 R48.2
OUT_OPAMP: C46.1 R69.1 R73.2 SUM_OPAMP.6(OUT)
OUT_POT: C50.+ R73.1 R75.2(S) R75.3(E)
OUT_VCF: C44.2 R55.2 VCF_OUT.P$1
PULSE_3340A: 3340A.4(PULSE_OUT) R8.2 SQU_A.P$1
PULSE_3340B: 3340B.4(PULSE_OUT) R7.2 SQU_B.P$1
RES_CUR_IN_VCF: R55.1 VCF1.8(OTA$1:IN_RES)
RES_CUR_VCF: Q_TM.A VCF1.9(POW$1:RES_CUR)
SAW_3340A: R15.1 SAW_A.P$1
SAW_3340B: R14.1 SAW_B.P$1
SCALE_3340A: 3340A.14(SCALE) R19.1
SCALE_3340B: 3340B.14(SCALE) R18.1
SCL: 24C04.6(SCL) F446.61(PB8) I2C.2 R84.1
SDA: 24C04.5(SDA) F446.62(PB9) I2C.1 R88.1
SOFT_SYNC_3340A: 3340A.9(SOFT_SYNC) C10.2
SOFT_SYNC_3340B: 3340B.9(SOFT_SYNC) C9.2
SUB_IN: SUB.3(A:CLK) SUB_IN.P$1
SUB_OUT2: SUB2.P$1 SUB.1(A:Q) SUB.13(B:CLK)
SUB_OUT4: SUB4.P$1 SUB.15(B:Q)
SW1: C63.1 F446.40(PC9) R85.2
SW2: C64.1 F446.39(PC8) R86.2
SWCLK: F446.49(PA14) STLINK.4
SWDIO: F446.46(PA13) STLINK.2
SYNC_3340A: C4.1 R27.2 SYNC_A.P$1
TEMPCO2_VCOA: 3340A.2(MUL_GAIN2) R17.1
TEMPCO2_VCOB: 3340B.2(MUL_GAIN2) R16.1
TIMING_CAP_3340A: 3340A.11(TIMING_CAP) C8.2
TIMING_CAP_3340B: 3340B.11(TIMING_CAP) C7.2
TRI_3340A: 3340A.10(TRI_OUT) TRI_A.P$1
TRI_3340B: 3340B.10(TRI_OUT) TRI_B.P$1
USART1_RX: F446.59(PB7) MIDI.1
USART1_TX: F446.58(PB6) MIDI.2
VCA_IN: R49.1 VCA_IN.P$1
VCAP1: C60.2 F446.30(VCAP_1)
VCF_ANASW_IN4: ADG453.8(IN4) IN34.2 R66.2
VEE_VCF: C40.1 R54.2 VCF1.13(POW$1:V-)
VEE_VCOA: 3340A.3(VEE) C2.2 R10.2 R12.2 R17.2
VEE_VCOB: 3340B.3(VEE) C1.2 R9.2 R11.2 R16.2
Unconnected: 3340A.7(CURRENT_CORR) 3340B.7(CURRENT_CORR) AD5644.10(VREFIN/VREFOUT) F446.2(PC13) F446.3(PC14-OSC32_IN) F446.4(PC15-OSC32_OUT) F446.8(PC0) F446.10(PC2) F446.11(PC3) F446.24(PC4) F446.25(PC5) F446.27(PB1) F446.28(PB2) F446.34(PB13) F446.35(PB14) F446.36(PB15) F446.37(PC6) F446.41(PA8) F446.42(PA9) F446.43(PA10) F446.44(PA11) F446.45(PA12) F446.54(PD2) F446.55(PB3) F446.56(PB4) F446.57(PB5) HOLE1.B096(MOUNT) HOLE2.B096(MOUNT) HOLE3.B096(MOUNT) HOLE4.B096(MOUNT) ITOV.1(ON) ITOV.5(CMP) ITOV.8(ON/CMP) MODRING.1(OTA1:I_BIAS) MODRING.2(OTA1:I_DIODE) MODRING.3(OTA1:IN_P) MODRING.4(OTA1:IN_N) MODRING.5(OTA1:OUT) MODRING.7(BUF1:B) MODRING.8(BUF1:E) MODRING.15(OTA2:I_DIODE) STLINK.6 SUM_OPAMP.1(ON) SUM_OPAMP.5(CMP) SUM_OPAMP.8(ON/CMP) VCA.2(OTA1:I_DIODE) VCA.7(BUF1:B) VCA.8(BUF1:E) VCA.9(BUF2:E) VCA.10(BUF2:B) VCA.12(OTA2:OUT) VCA.13(OTA2:IN_N) VCA.14(OTA2:IN_P) VCA.15(OTA2:I_DIODE) VCA.16(OTA2:I_BIAS)

### Notes on the sheet
- Mixers A and B, 4 channels each (w/o VCA channel) | AS3320 VCF | STM32F446
- VCO3340B
- According to the AS3320 datasheet, 
  control voltage at pin 12 ranges from
  0 to 200mV.
- ERREUR corrigée sur la v7.1 (oubli de connection au 5V et du GND)
- Ajouter une capa de liaison !
- Low Pass 4th Order
- Low Pass 2nd Order
- current -> voltage converter
- Connect 2 and 3 to bypass VCF.
  Otherwise connect 1 with 2, and
  3 with 4.
- VCO3340A
- !!!! Erreurs de routage de la v7 corrigée sur la 7.1 !!!!
  Au moment de l'équipement de la carte il fallait  :
  - inverser le condo polarisé C54 (+ côté 0V et non côté -15V)
  - inverser la LED "-15V" (pour la même raison)
- VCA | Output summing stage | POWER | DAC (12 ch 8 bits + 4 ch 14 bits)
- Note: for a polyphonic synth, 
  voice summing is performed 
  here on the inverting input 
  of the op amp.
- Connecté sur SPI1: 
  - CLK=PA5
  - MOSI=PA7
  - NSS=PA4
- Connecté sur SPI2: 
  - CLK=PB10
  - MOSI=PC1
  - NSS=PB12
- Channels:
  A01-12 = 8 bits
  B01-04 = 14 bits
  
  - A01 à A08 : 2164D vca
  - A09 : VCF cutoff
  - A10 : VCF Q
  - A11 : PWM 3340A
  - A12 : PWM 3340B
  
  - B01 : CV 3340A
  - B02 : CV 3340B
  - B03 : noise / wave generator (VCO #3)
  - B04 : VCA LM13700
- Protection againt short circuits
- MOD RING

## Sheet 2 of 2

## Library data of the parts
0V/5V/-15V/+15V SUM_CON = con-lstb:MA04-2: PIN HEADER; OC_FARNELL: unknown; OC_NEWARK: unknown
3V3 5V +15V -15V GREEN RED1 RED2 = Passives:LED
24C04 = microchip:24*: Serial EEPROM I2C; MF: RAMTRON INTERNATIONAL CORP; MPN: FM24C04A-P; OC_FARNELL: 1094258; OC_NEWARK: 97H6447
2164A 2164B = analog-audio-chips:SSM2164: Low Cost Quad Voltage Controlled Amplifier by Analog Devices (120 dB Gain Range)
3340A 3340B = analog-audio-chips:CEM3340: Voltage Controlled Oscillator designed by Curtis.
A1-A4 B1-B4 CAL_A CAL_B CAL_IN_A CAL_IN_B CUTOFF CV_A CV_B FM_B IN9 IN10 MIXOUT Q SAW_A SAW_B SQU_A SQU_B SUB2 SUB4 SUB_IN SYNC_A SYNC_B TRI_A TRI_B VCA_CV VCA_IN VCA_OUT VCF_IN VCF_OUT XIN XMOD = 6P1_EVB:TESTPOINT
A02/1/12/11 ABCD EXT = con-lstb:MA04-1: PIN HEADER; OC_FARNELL: unknown; OC_NEWARK: unknown
A010/9/8/7/3/4/5/6 GAINS = con-lstb:MA08-1: PIN HEADER; OC_FARNELL: unknown; OC_NEWARK: unknown
AD5644 = Analog Devices - AD5644RBRMZ-5:ANALOG_DEVICES_AD5644RBRMZ-5: ADI-AD5644R-RM-10; CIIVA_IDS: 963927; COMPONENT_LINK_1_DESCRIPTION: Manufacturer URL; COMPONENT_LINK_1_URL: http://www.analog.com/en/index.html; COMPONENT_LINK_3_DESCRIPTION: Package Specification; COMPONENT_LINK_3_URL: http://www.analog.com/static/imported-files/packages/PKG_PDF/MSOP%28RM%29/RM_10.pdf; COMPONENT_LINK_4_DESCRIPTION: Product URL; COMPONENT_LINK_4_URL: http://www.analog.com/en/digital-to-analog-converters/da-converters/ad5644r/products/product.html; DAC_OUTPUTS: 4; DATASHEET: http://www.analog.com/static/imported-files/data_sheets/AD5624R_5644R_5664R.pdf; DATASHEET_VERSION: Rev.B; FOOTPRINT_VARIANT_NAME_0: Level C; FOOTPRINT_VARIANT_NAME_1: Level B; FOOTPRINT_VARIANT_NAME_2: Level A; IMPORTED: yes; IMPORTED_FROM: vault; IMPORT_TS: 1521855052; MAX_V: 5.5V; MF: Analog Devices; MOUNTING_TECHNOLOGY: Surface Mount; MPN: AD5644RBRMZ-5; OP_PWR_DISS: 6.6mW; PACKAGE: RM-10; PACKAGE_DESCRIPTION: 10-Lead Mini Small Outline Package [MSOP]; PACKAGE_VERSION: May-2005; PACKING: Tube; PIN_0_0_6_INSIDE_EDGE: clock; PREFIX: U; RELEASE_DATE: 1387041291; RESOLUTION_BITS: 14; ROHS: Yes; SETTLING_TIME: 3.5Âμs; SINGLE_SUPPLY: Yes; VAULT_GUID: 80AB4FD1-89D4-49BA-A3F3-5D59DB24CB1A; VAULT_REVISION: 6F701BB3-0F34-4771-8D13-1575DC664D0F
ADG453 = ADG453BRZ:ADG453BRZ: Analog Devices ADG453BRZ, Analogue SPST Switch Quad SPST, 9 V, 16-Pin SOIC Source: Datasheet <http://uk.rs-online.com/web/p/products/0412539P>; DESCRIPTION: Analog Devices ADG453BRZ, Analogue SPST Switch Quad SPST, 9 V, 16-Pin SOIC; HEIGHT: 1.75mm; MANUFACTURER_NAME: Analog Devices; MANUFACTURER_PART_NUMBER: ADG453BRZ; MOUSER_PART_NUMBER: 584-ADG453BRZ; MOUSER_PRICE-STOCK: https://www.mouser.com/Search/Refine.aspx?Keyword=584-ADG453BRZ; RS_PART_NUMBER: 0412539P; RS_PRICE-STOCK: http://uk.rs-online.com/web/p/products/0412539P
ANAIN IN34 SD3 SD4 = stm32_pi_board:MA02-1: Headers & Wire Housing, 1 Row, 3 Position
BH2221 = BH2221FV:BH2221FV
C1-C16 C25-C34 C36-C46 C49 C51 C52 C61 C72 C74-C88 = rcl:C-EU: CAPACITOR, European symbol; SPICEPREFIX: C
C17-C24 C35 = rcl:C-EU: CAPACITOR, European symbol; C3: 0.47 micro; SPICEPREFIX: C
C50 = resistor:CPOL-EU: POLARIZED CAPACITOR, European symbol
C53 C54 C58 C59 C62 C65 C73 = MyComponents:CPOL-US: SMT Tantalum Capacitor; MOUSER: 581-TPSE477K010R0200
C55-C57 C60 C66-C71 = MyComponents:C-US: SMD Multilayer Ceramic Capacitor; MOUSER: 80-C0805C104J5RAUTO
C63 C64 = 6P1_EVB:C-EU: CAPACITOR, European symbol
CV_TM HIGH_A HIGH_B LOW_A LOW_B Q_TM TEMCOA TEMCOB = adafruit:TRIM
F446 = STM32F446RCT7:STM32F446RCT7: 32 Bit Microcontroller, High Performance, ARM Cortex-M4, 180 MHz, 256 KB, 128 KB, 64, LQFP; AVAILABILITY: Unavailable; DESCRIPTION: ARM® Cortex®-M4 STM32F4 Microcontroller IC 32-Bit 180MHz 256KB (256K x 8) FLASH 64-LQFP (10x10); DIGIKEY-PURCHASE-URL: https://snapeda.com/shop?store=DigiKey&id=703054; MF: STMicroelectronics; MP: STM32F446RCT7; PACKAGE: LQFP-64 STMicroelectronics; PRICE: None
HOLE1-HOLE4 = 52101-101-REV-A:HOLES_MOUNT-PAD-ROUND-: MOUNTING PAD, round; BOM: EXCLUDE
I2C MIDI = con-lstb:MA03-1: PIN HEADER; OC_FARNELL: unknown; OC_NEWARK: unknown
I_SUM = con-lstb:MA08-2: PIN HEADER; OC_FARNELL: unknown; OC_NEWARK: unknown
ITOV SUM_OPAMP = linear:NE5534: LOW-NOISE OPERATIONAL AMPLIFIER Source: http://focus.ti.com/lit/ds/symlink/ne5534.pdf
JACK = con-lumberg:1502_01: Jack connectors according to JISC 6560, 3.5 mm Klinkensteckverbinder nach JISC 6560, 3,5 mm Source: http://www.lumberg.com/Produkte/PDFs/1502_01.pdf; OC_FARNELL: 4739747; OC_NEWARK: unknown
L1 = MyComponents:L-US: SMD Ferrite Bead; MOUSER: 963-CKP2012N1R0M-T
MODRING VCA = ota:LM13700: Dual OTA with buffers
Q1 = MyComponents:Q-HSE: HSE SMD Crystal; MOUSER: 520-160-20-46X
R1-R74 R76-R78 = rcl:R-EU_: RESISTOR, European symbol; SPICEPREFIX: R
R75 = pot:3RP/1610N: 16mm Potentiometer one level Source: http://www.alphapotentiometers.net/html/16mm_pot_2.html
R79-R81 R87 R89-R95 = MyComponents:R-US: SMD Resistor; MOUSER: 660-RK73H2ATTDD1R00F
R82-R86 R88 = 6P1_EVB:R-US_: RESISTOR, American symbol
RST SW1 SW2 = switch-omron:10-XX: OMRON SWITCH; MPN: B3F-1000; OC_FARNELL: 176432; OC_NEWARK: 36M3542
STLINK = MyComponents:MA03-2: Headers & Wire Housing, 2 Row, 6 Position; MOUSER: 649-75867-331LF
SUB = 40xx:4027: Dual JK FLIP FLOP
TLV75533 = TLV75533PDBVR:TLV75533PDBVR: 500mA Low-IQ Small-Size Low-Dropout (LDO) Regulator 5-SOT-23 -40 to 125; AVAILABILITY: Unavailable; DESCRIPTION: Linear Voltage Regulator IC 1 Output 500mA SOT-23-5; MF: Texas Instruments; MP: TLV75533PDBVR; PACKAGE: SOT-23 Texas Instruments; PRICE: None
VCF1 = analog-audio-chips:AS3320: Voltage Controlled Filter capable of 4th order LP, BP or HP designed by famous audio chips designer Curtis Electronics.